# Altium schematic sheet Motherboard.SchDoc
size D
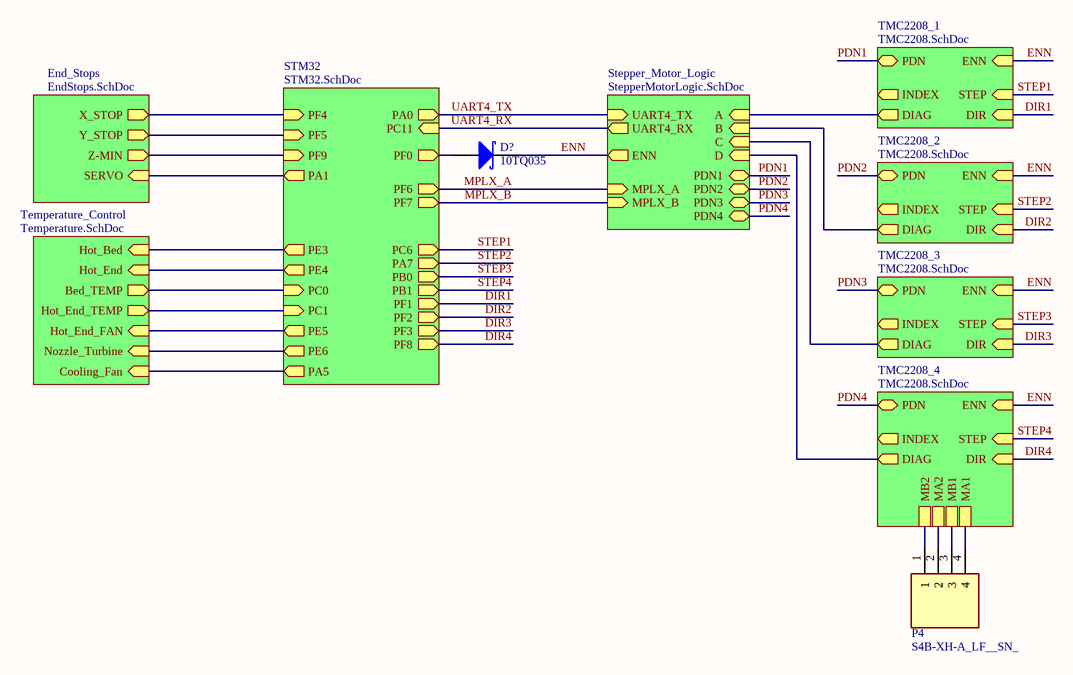
[diagram p0: Motherboard.SchDoc]

## Parts
D?  10TQ035  [TO-220AC]
P4  S4B-XH-A_LF__SN_  [SHDRRA4W64P0X250_1X4_1240X1150X700P]

## Sub-sheets
End_Stops = EndStops.SchDoc: X_STOP (out), Y_STOP (out), Z-MIN (out), SERVO (in)
Stepper_Motor_Logic = StepperMotorLogic.SchDoc: A (in), B (in), C (in), D (in), ENN (out), UART4_TX (in), UART4_RX (out), MPLX_A (in), MPLX_B (in), PDN1 (bidir), PDN2 (bidir), PDN3 (bidir), PDN4 (bidir)
STM32 = STM32.SchDoc: PA0 (out), PC11 (in), PF6 (out), PF7 (out), PF0 (out), PC6 (out), PA7 (out), PB0 (out), PB1 (out), PF8 (out), PF1 (out), PF2 (out), PF3 (out), PE3 (out), PE4 (out), PC0 (in), PC1 (in), PE5 (out), PF4 (in), PF5 (in), PE6 (out), PA5 (out), PA1 (out), PF9 (in)
Temperature_Control = Temperature.SchDoc: Hot_Bed (in), Hot_End (in), Bed_TEMP (out), Hot_End_TEMP (out), Hot_End_FAN (in), Nozzle_Turbine (in), Cooling_Fan (in)
TMC2208_1 = TMC2208.SchDoc: ENN (in), PDN (bidir), STEP (in), DIR (in), INDEX (out), DIAG (out)
TMC2208_2 = TMC2208.SchDoc: ENN (in), PDN (bidir), STEP (in), DIR (in), INDEX (out), DIAG (out)
TMC2208_3 = TMC2208.SchDoc: ENN (in), PDN (bidir), STEP (in), DIR (in), INDEX (out), DIAG (out)
TMC2208_4 = TMC2208.SchDoc: ENN (in), PDN (bidir), STEP (in), DIR (in), INDEX (out), DIAG (out), MB2, MA2, MB1, MA1

## Nets
DIR1: sheet TMC2208_1/DIR, sheet STM32/PF1
DIR2: sheet TMC2208_2/DIR, sheet STM32/PF2
DIR3: sheet TMC2208_3/DIR, sheet STM32/PF3
DIR4: sheet TMC2208_4/DIR, sheet STM32/PF8
ENN: D?.1(K) ; sheet TMC2208_1/ENN, sheet TMC2208_2/ENN, sheet TMC2208_3/ENN, sheet TMC2208_4/ENN, sheet Stepper_Motor_Logic/ENN
MPLX_A: sheet STM32/PF6, sheet Stepper_Motor_Logic/MPLX_A
MPLX_B: sheet STM32/PF7, sheet Stepper_Motor_Logic/MPLX_B
PDN1: sheet TMC2208_1/PDN, sheet Stepper_Motor_Logic/PDN1
PDN2: sheet TMC2208_2/PDN, sheet Stepper_Motor_Logic/PDN2
PDN3: sheet TMC2208_3/PDN, sheet Stepper_Motor_Logic/PDN3
PDN4: sheet TMC2208_4/PDN, sheet Stepper_Motor_Logic/PDN4
STEP1: sheet TMC2208_1/STEP, sheet STM32/PC6
STEP2: sheet TMC2208_2/STEP, sheet STM32/PA7
STEP3: sheet TMC2208_3/STEP, sheet STM32/PB0
STEP4: sheet TMC2208_4/STEP, sheet STM32/PB1
UART4_RX: sheet STM32/PC11, sheet Stepper_Motor_Logic/UART4_RX
UART4_TX: sheet STM32/PA0, sheet Stepper_Motor_Logic/UART4_TX
NetD?_3: D?.3(A) ; sheet STM32/PF0
NetP4_1: P4.1 ; sheet TMC2208_4/MB2
NetP4_2: P4.2 ; sheet TMC2208_4/MA2
NetP4_3: P4.3 ; sheet TMC2208_4/MB1
NetP4_4: P4.4 ; sheet TMC2208_4/MA1
(unnamed): sheet TMC2208_1/DIAG, sheet Stepper_Motor_Logic/A
(unnamed): sheet TMC2208_2/DIAG, sheet Stepper_Motor_Logic/B
(unnamed): sheet TMC2208_3/DIAG, sheet Stepper_Motor_Logic/C
(unnamed): sheet TMC2208_4/DIAG, sheet Stepper_Motor_Logic/D
(unnamed): sheet STM32/PE3, sheet Temperature_Control/Hot_Bed
(unnamed): sheet STM32/PE4, sheet Temperature_Control/Hot_End
(unnamed): sheet STM32/PC0, sheet Temperature_Control/Bed_TEMP
(unnamed): sheet STM32/PC1, sheet Temperature_Control/Hot_End_TEMP
(unnamed): sheet STM32/PE5, sheet Temperature_Control/Hot_End_FAN
(unnamed): sheet STM32/PF4, sheet End_Stops/X_STOP
(unnamed): sheet STM32/PF5, sheet End_Stops/Y_STOP
(unnamed): sheet STM32/PE6, sheet Temperature_Control/Nozzle_Turbine
(unnamed): sheet STM32/PA5, sheet Temperature_Control/Cooling_Fan
(unnamed): sheet STM32/PA1, sheet End_Stops/SERVO
(unnamed): sheet STM32/PF9, sheet End_Stops/Z-MIN

## Library data of the parts
D? = Diode 10TQ035: Schottky Rectifier; Note: Terminal 2 is the TAB and is electrically connected to the cathode; Published: 8-Jun-2000; LatestRevisionDate: 17-Jul-2002; LatestRevisionNote: Re-released for DXP Platform.; DatasheetVersion: PD-2.057B; PackageVersion: Feb-1998; PackageReference: TO-220AC; Publisher: Altium Limited; PackageDescription: TO, Thru-Hole, Vertical, Heatsink Mounted; 3 In-Line Leads (1 Absent); Pitch 2.54 mm; ComponentLink1Description: Manufacturer Link; ComponentLink1URL: http://www.irf.com/; ComponentLink2Description: Datasheet; ComponentLink2URL: http://www.irf.com/product-info/datasheets/data/10tq.pdf
P4 = S4B-XH-A_LF__SN_: Connector; Manufacturer_Name: JST (JAPAN SOLDERLESS TERMINALS); Manufacturer_Part_Number: S4B-XH-A(LF)(SN); Datasheet Link: http://www.jst-mfg.com/product/pdf/eng/eXH.pdf; Height: 7mm; Arrow Part Number: S4B-XH-A(LF)(SN); Arrow Price/Stock: https://www.arrow.com/en/products/s4b-xh-a-lf-sn/jst-manufacturing